# EAGLE design farmcontroller (EAGLE 8.3.0)
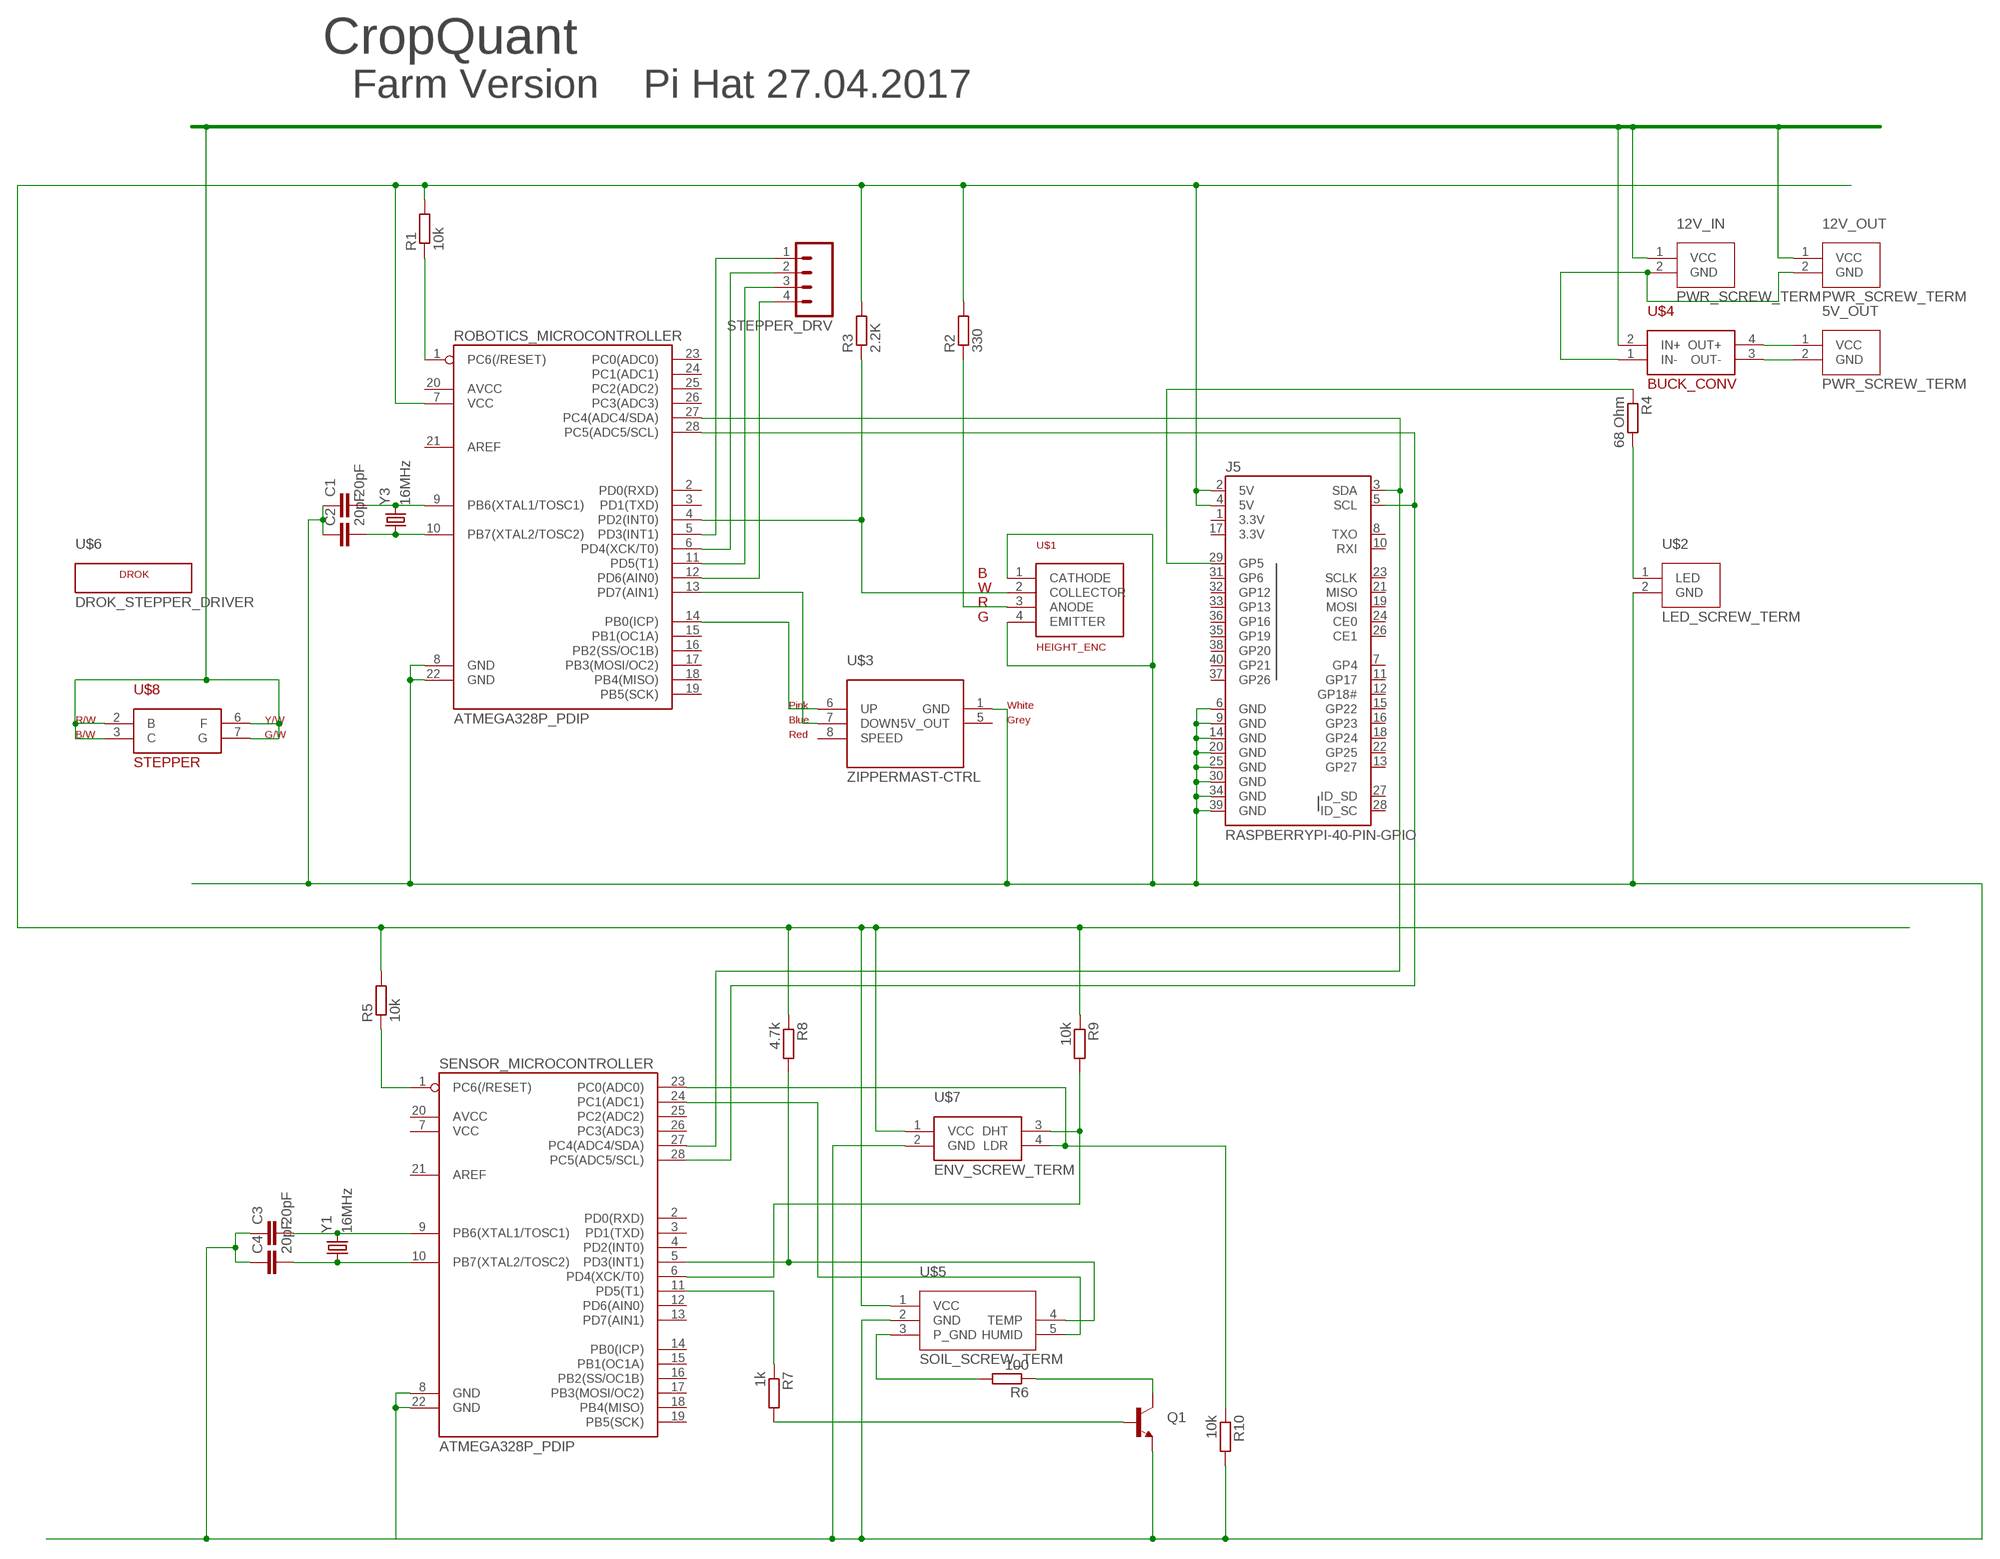
[diagram p0: schematic, sheet 1]

## Parts
5V_OUT  PWR_SCREW_TERM  [PWR_SCREW_TERM]
12V_IN  PWR_SCREW_TERM  [PWR_SCREW_TERM]
12V_OUT  PWR_SCREW_TERM  [PWR_SCREW_TERM]
C1  20pF  CAPPTH  [CAP-PTH-SMALL]
C2  20pF  CAPPTH  [CAP-PTH-SMALL]
C3  20pF  CAPPTH  [CAP-PTH-SMALL]
C4  20pF  CAPPTH  [CAP-PTH-SMALL]
J5  RASPBERRYPI-40-PIN-GPIO  [2X20-SHROUDED]
Q1  TRANSISTOR_NPNP2N2222A  [TO-92]
R1  10k  R-EU_0204/7  [0204/7]
R2  330  R-EU_0204/7  [0204/7]
R3  2.2K  R-EU_0204/7  [0204/7]
R4  68 Ohm  R-EU_0204/7  [0204/7]
R5  10k  R-EU_0204/7  [0204/7]
R6  100  R-EU_0204/7  [0204/7]
R7  1k  R-EU_0204/7  [0204/7]
R8  4.7k  R-EU_0204/7  [0204/7]
R9  10k  R-EU_0204/7  [0204/7]
R10  10k  R-EU_0204/7  [0204/7]
ROBOTICS_MICROCONTROLLER  ATMEGA328P_PDIP  [DIL28-3]
SENSOR_MICROCONTROLLER  ATMEGA328P_PDIP  [DIL28-3]
STEPPER_DRV  M04PTH  [1X04]
U$1  HEIGHT_ENC  [HEIGHT_ENC]
U$2  LED_SCREW_TERM  [LED_SCREW_TERM]
U$3  ZIPPERMAST-CTRL  [ZIPPERMAST-CTRL]
U$4  BUCK_CONV  [BUCK_CONV]
U$5  SOIL_SCREW_TERM  [SOIL_SCREW_TERM]
U$6  DROK_STEPPER_DRIVER  [DROK_STEPPER_DRIVER]
U$7  ENV_SCREW_TERM  [ENV_SCREW_TERM]
U$8  STEPPER  [STEPPER]
Y1  16MHz  CRYSTALHC49US  [HC49US]
Y3  16MHz  CRYSTALHC49US  [HC49US]

## Nets
N$1: R6.2 U$5.3(P_GND)
N$2: J5.2(5V) J5.4(5V) R1.2 R2.2 R3.2 R5.2 R8.1 R9.1 ROBOTICS_MICROCONTROLLER.7(VCC) U$5.1(VCC) U$7.1(VCC)
N$3: R1.1 ROBOTICS_MICROCONTROLLER.1(PC6(/RESET))
N$4: J5.3(SDA) ROBOTICS_MICROCONTROLLER.27(PC4(ADC4/SDA)) SENSOR_MICROCONTROLLER.27(PC4(ADC4/SDA))
N$5: J5.5(SCL) ROBOTICS_MICROCONTROLLER.28(PC5(ADC5/SCL)) SENSOR_MICROCONTROLLER.28(PC5(ADC5/SCL))
N$6: ROBOTICS_MICROCONTROLLER.14(PB0(ICP)) U$3.6(UP)
N$7: ROBOTICS_MICROCONTROLLER.13(PD7(AIN1)) U$3.7(DOWN)
N$8: R5.1 SENSOR_MICROCONTROLLER.1(PC6(/RESET))
N$9: R2.1 U$1.3(ANODE)
N$10: R3.1 ROBOTICS_MICROCONTROLLER.4(PD2(INT0)) U$1.2(COLLECTOR)
N$11: 12V_IN.1(VCC) 12V_OUT.1(VCC) U$4.2(IN+) U$8.2(B) U$8.3(C) U$8.6(F) U$8.7(G)
N$12: C2.2 ROBOTICS_MICROCONTROLLER.10(PB7(XTAL2/TOSC2)) Y3.1
N$13: C3.2 SENSOR_MICROCONTROLLER.9(PB6(XTAL1/TOSC1)) Y1.2
N$14: R4.2 U$2.1(LED)
N$15: J5.29(GP5) R4.1
N$16: C4.2 SENSOR_MICROCONTROLLER.10(PB7(XTAL2/TOSC2)) Y1.1
N$17: 12V_IN.2(GND) 12V_OUT.2(GND) U$4.1(IN-)
N$18: 5V_OUT.1(VCC) U$4.4(OUT+)
N$19: 5V_OUT.2(GND) U$4.3(OUT-)
N$20: C1.2 ROBOTICS_MICROCONTROLLER.9(PB6(XTAL1/TOSC1)) Y3.2
N$21: Q1.1(C) R6.1
N$22: C1.1 C2.1 C3.1 C4.1 J5.6(GND) J5.9(GND) J5.14(GND) J5.20(GND) J5.25(GND) J5.30(GND) J5.34(GND) J5.39(GND) Q1.3(E) R10.2 ROBOTICS_MICROCONTROLLER.8(GND) ROBOTICS_MICROCONTROLLER.22(GND) SENSOR_MICROCONTROLLER.8(GND) SENSOR_MICROCONTROLLER.22(GND) U$1.1(CATHODE) U$1.4(EMITTER) U$2.2(GND) U$3.1(GND) U$5.2(GND) U$7.2(GND)
N$23: Q1.2(B) R7.2
N$24: ROBOTICS_MICROCONTROLLER.5(PD3(INT1)) STEPPER_DRV.1
N$25: R7.1 SENSOR_MICROCONTROLLER.11(PD5(T1))
N$26: ROBOTICS_MICROCONTROLLER.6(PD4(XCK/T0)) STEPPER_DRV.2
N$27: ROBOTICS_MICROCONTROLLER.11(PD5(T1)) STEPPER_DRV.3
N$28: ROBOTICS_MICROCONTROLLER.12(PD6(AIN0)) STEPPER_DRV.4
N$29: SENSOR_MICROCONTROLLER.24(PC1(ADC1)) U$5.5(HUMID)
N$30: R8.2 SENSOR_MICROCONTROLLER.5(PD3(INT1)) U$5.4(TEMP)
N$31: R9.2 SENSOR_MICROCONTROLLER.6(PD4(XCK/T0)) U$7.3(DHT)
N$32: R10.1 SENSOR_MICROCONTROLLER.23(PC0(ADC0)) U$7.4(LDR)
Unconnected: J5.7(GP4) J5.8(TXO) J5.10(RXI) J5.11(GP17) J5.12(GP18#) J5.13(GP27) J5.15(GP22) J5.16(GP23) J5.18(GP24) J5.19(MOSI) J5.21(MISO) J5.22(GP25) J5.23(SCLK) J5.24(CE0) J5.26(CE1) J5.27(ID_SD) J5.28(ID_SC) J5.31(GP6) J5.32(GP12) J5.33(GP13) J5.35(GP19) J5.36(GP16) J5.37(GP26) J5.38(GP20) J5.40(GP21) ROBOTICS_MICROCONTROLLER.2(PD0(RXD)) ROBOTICS_MICROCONTROLLER.3(PD1(TXD)) ROBOTICS_MICROCONTROLLER.15(PB1(OC1A)) ROBOTICS_MICROCONTROLLER.16(PB2(SS/OC1B)) ROBOTICS_MICROCONTROLLER.17(PB3(MOSI/OC2)) ROBOTICS_MICROCONTROLLER.18(PB4(MISO)) ROBOTICS_MICROCONTROLLER.19(PB5(SCK)) ROBOTICS_MICROCONTROLLER.20(AVCC) ROBOTICS_MICROCONTROLLER.21(AREF) ROBOTICS_MICROCONTROLLER.23(PC0(ADC0)) ROBOTICS_MICROCONTROLLER.24(PC1(ADC1)) ROBOTICS_MICROCONTROLLER.25(PC2(ADC2)) ROBOTICS_MICROCONTROLLER.26(PC3(ADC3)) SENSOR_MICROCONTROLLER.2(PD0(RXD)) SENSOR_MICROCONTROLLER.3(PD1(TXD)) SENSOR_MICROCONTROLLER.4(PD2(INT0)) SENSOR_MICROCONTROLLER.7(VCC) SENSOR_MICROCONTROLLER.12(PD6(AIN0)) SENSOR_MICROCONTROLLER.13(PD7(AIN1)) SENSOR_MICROCONTROLLER.14(PB0(ICP)) SENSOR_MICROCONTROLLER.15(PB1(OC1A)) SENSOR_MICROCONTROLLER.16(PB2(SS/OC1B)) SENSOR_MICROCONTROLLER.17(PB3(MOSI/OC2)) SENSOR_MICROCONTROLLER.18(PB4(MISO)) SENSOR_MICROCONTROLLER.19(PB5(SCK)) SENSOR_MICROCONTROLLER.20(AVCC) SENSOR_MICROCONTROLLER.21(AREF) SENSOR_MICROCONTROLLER.25(PC2(ADC2)) SENSOR_MICROCONTROLLER.26(PC3(ADC3)) U$3.5(5V_OUT) U$3.8(SPEED)

## Notes on the sheet
- CropQuant
- Farm Version | Pi Hat 27.04.2017

## Power pins joined to a net without a drawn wire
3.3V: J5.1(3.3V) J5.17(3.3V)

## Library data of the parts
5V_OUT 12V_IN 12V_OUT = 000_CropQuant:PWR_SCREW_TERM
C1-C4 = SparkFun-Capacitors:CAP: Capacitor Standard 0603 ceramic capacitor, and 0.1" leaded capacitor.
J5 = CropQuant:RASPBERRYPI-40-PIN-GPIO: Second Generation Raspberry Pi GPIO Header 2x20 pin connector, as found on B, B+, A+ models.
Q1 = 001_SparkFun-DiscreteSemi:TRANSISTOR_NPN: Generic NPN BJT MMBT2222A - TRANS-08049 (SOT-23, 1A 40V) MPSA42 - TRANS-09116 (SOT-23, 500mA 300V) MMBT5088LT1G - TRANS-11160 (SOT-23, 50 mA 30V) BC547 - COM-08928 <http://www.sparkfun.com/products/8928> (TO-92 45V 100mA) (1.Collector 2.Base 3.Emitter) 2N3904 - COM-00521 <http://www.sparkfun.com/products/521> (TO-92 40V 200mA) (1.Emitter 2.Base 3.Collector) P2N2222A - COM-12852 <http://www.sparkfun.com/products/12852> (TO-92 40V 600mA) (1.Collector 2.Base 3.Emitter); PROD_ID: TRANS-09536
R1-R10 = resistor:R-EU_: RESISTOR, European symbol
ROBOTICS_MICROCONTROLLER SENSOR_MICROCONTROLLER = 001_SparkFun-DigitalIC:ATMEGA328P_PDIP: uC used in the Arduino 32kb flash, 1k EEPROM, 2k SRAM This is the through-hole version of this chip.
STEPPER_DRV = SparkFun-Connectors:M04: Header 4 Standard 4-pin 0.1" header. Use with straight break away headers (SKU : PRT-00116), right angle break away headers (PRT-00553), swiss pins (PRT-00743), machine pins (PRT-00117), and female headers (PRT-00115). Molex polarized connector foot print use with SKU : PRT-08231 with associated crimp pins and housings. 1MM SMD Version SKU: PRT-10208; PROD_ID: CONN-09696
U$1 = 000_CropQuant:HEIGHT_ENC
U$2 = 000_CropQuant:LED_SCREW_TERM
U$3 = 000_CropQuant:ZIPPERMAST-CTRL
U$4 = CropQuant:BUCK_CONV
U$5 = 000_CropQuant:SOIL_SCREW_TERM
U$6 = CropQuant:DROK_STEPPER_DRIVER
U$7 = 000_CropQuant:ENV_SCREW_TERM
U$8 = 000_CropQuant:STEPPER
Y1 Y3 = 001_SparkFun-FreqCtrl:CRYSTAL: Various standard crystals. Proven footprints.

## Board
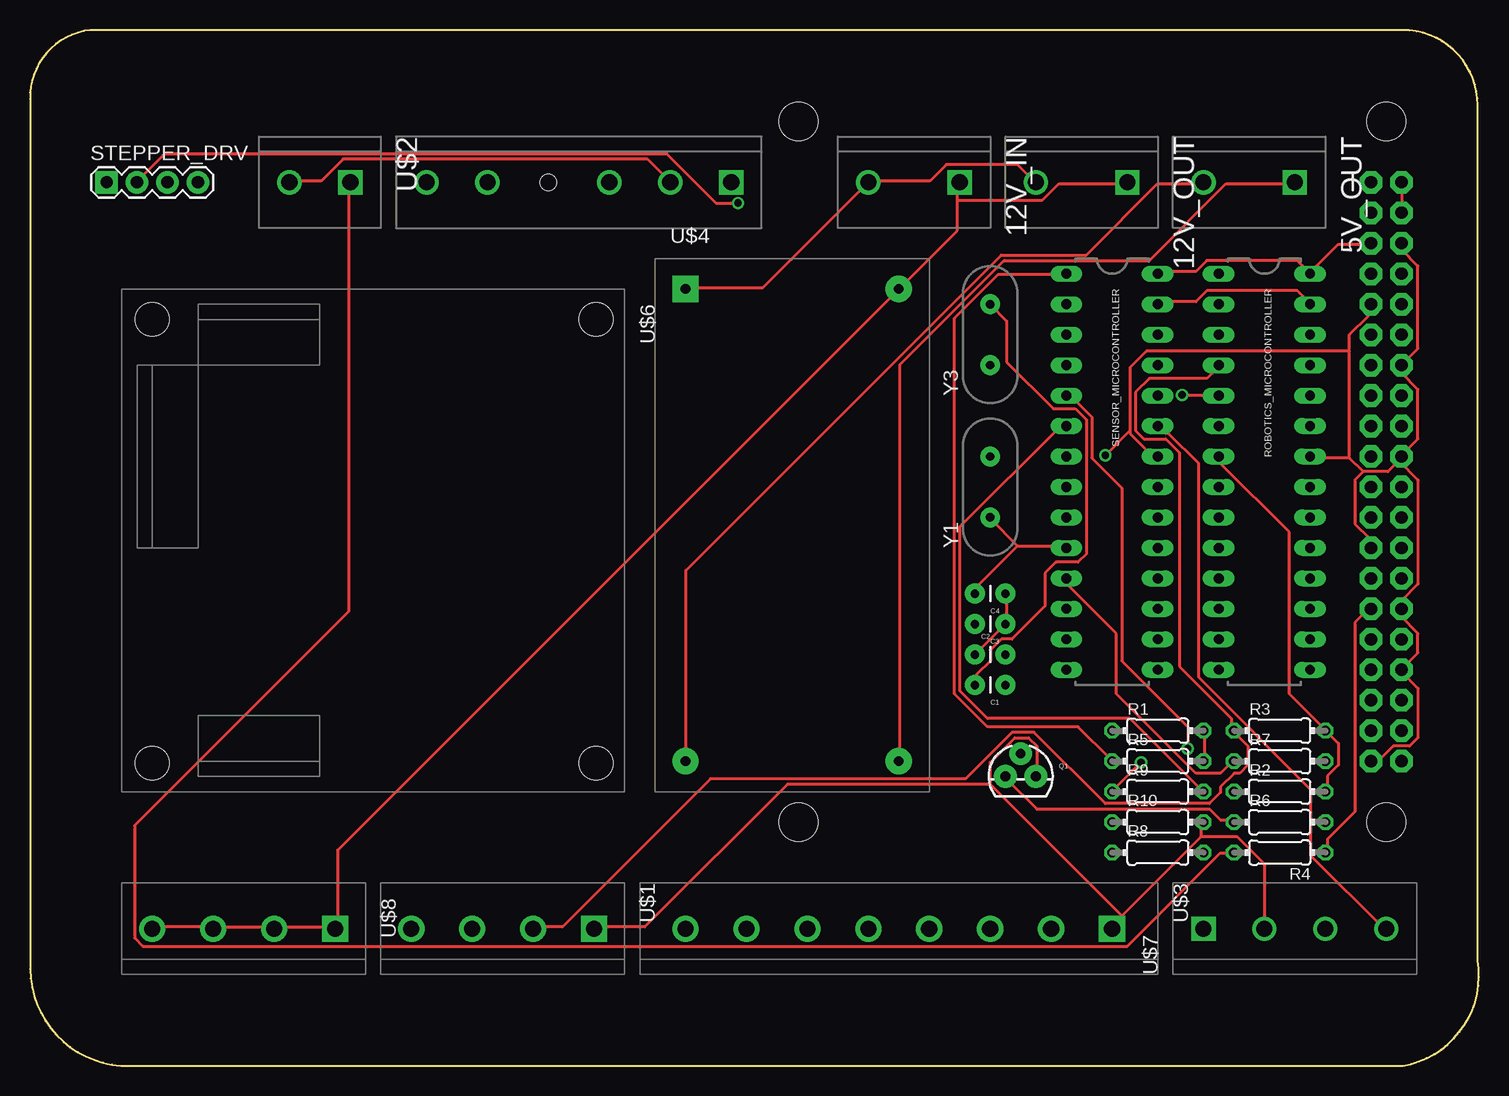
[diagram p1: board, top side]
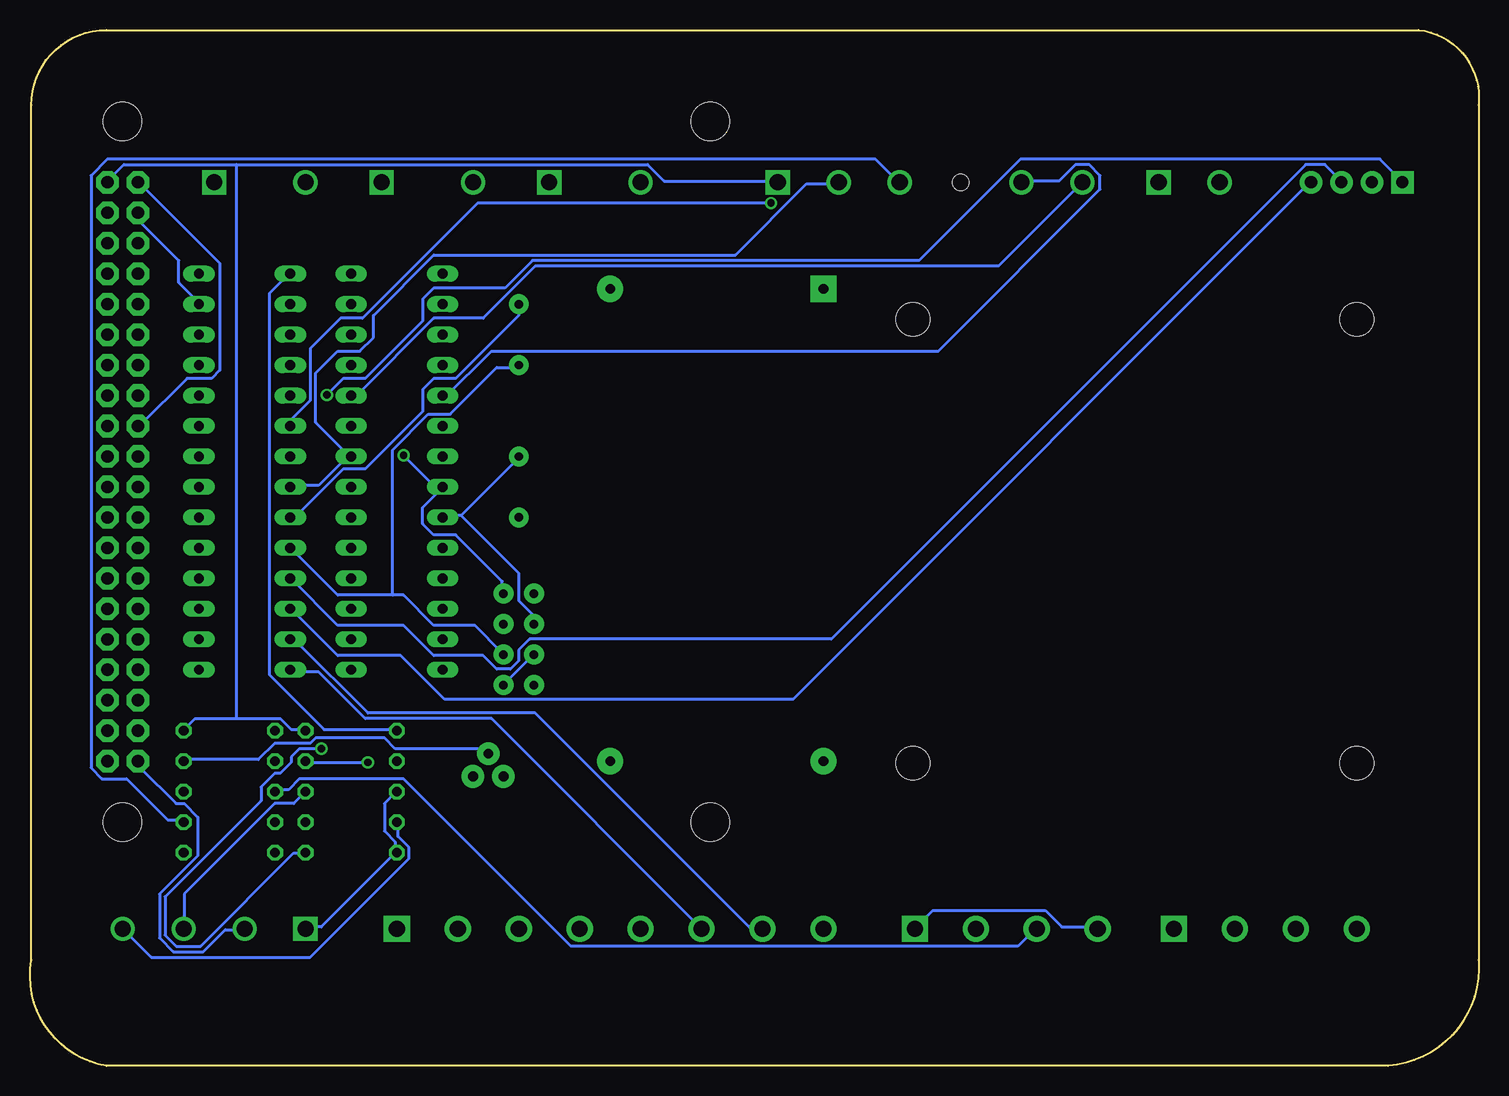
[diagram p2: board, bottom side, seen from below]

Size 120.79 x 86.36 mm. Coordinates in mm from the lower left corner, seen from the top.
Outline: 120.68,8.81 120.68,80.09 arc90 114.41,86.36 5.03,86.36 arc90 0.03,80.09 0.03,8.81 arc90 7.57,0 114.41,0 arc90 120.68,8.81
Copper layers (1*16): Top 0.035mm / dielectric 1.5mm / Bottom 0.035mm
Design rules "default": minimum track width 10mil, minimum drill 24mil, track to track 8mil, track to pad 8mil, pad to pad 8mil, via to via 8mil, smd to smd 8mil, copper to edge 40mil, drill to drill 8mil, minimum pad ring 10mil, minimum via ring 8mil, stop-mask expansion 4mil, vias tented up to drill 0mil, thermal gap 10mil

### Footprints (pad centres in the part's own frame; a part is rotated, then mirrored left to right if it is on the bottom)
PWR_SCREW_TERM = drill 1.346 square: 1 0,3.81 | drill 1.346: 2 0,-3.81
CAP-PTH-SMALL = drill 0.7 pad 1.651: 1 0,0; 2 2.54,0
2X20-SHROUDED = drill 1.016 pad 1.88 octagon: 1 -1.27,24.13; 2 1.27,24.13; 3 -1.27,21.59; 4 1.27,21.59; 5 -1.27,19.05; 6 1.27,19.05; 7 -1.27,16.51; 8 1.27,16.51; 9 -1.27,13.97; 10 1.27,13.97; 11 -1.27,11.43; 12 1.27,11.43; 13 -1.27,8.89; 14 1.27,8.89; 15 -1.27,6.35; 16 1.27,6.35; 17 -1.27,3.81; 18 1.27,3.81; 19 -1.27,1.27; 20 1.27,1.27; 21 -1.27,-1.27; 22 1.27,-1.27; 23 -1.27,-3.81; 24 1.27,-3.81; 25 -1.27,-6.35; 26 1.27,-6.35; 27 -1.27,-8.89; 28 1.27,-8.89; 29 -1.27,-11.43; 30 1.27,-11.43; 31 -1.27,-13.97; 32 1.27,-13.97; 33 -1.27,-16.51; 34 1.27,-16.51; 35 -1.27,-19.05; 36 1.27,-19.05; 37 -1.27,-21.59; 38 1.27,-21.59; 39 -1.27,-24.13; 40 1.27,-24.13 | hole 3.2: 0,29.21; 0,-29.21; -49,29.21; -49,-29.21
TO-92 = drill 0.813 pad 1.88: 1 -1.27,0; 2 0,1.905; 3 1.27,0
0204/7 = drill 0.813 octagon: 1 -3.81,0; 2 3.81,0
DIL28-3 = drill 0.813 long: 1 -16.51,-3.81; 2 -13.97,-3.81; 3 -11.43,-3.81; 4 -8.89,-3.81; 5 -6.35,-3.81; 6 -3.81,-3.81; 7 -1.27,-3.81; 8 1.27,-3.81; 9 3.81,-3.81; 10 6.35,-3.81; 11 8.89,-3.81; 12 11.43,-3.81; 13 13.97,-3.81; 14 16.51,-3.81; 15 16.51,3.81; 16 13.97,3.81; 17 11.43,3.81; 18 8.89,3.81; 19 6.35,3.81; 20 3.81,3.81; 21 1.27,3.81; 22 -1.27,3.81; 23 -3.81,3.81; 24 -6.35,3.81; 25 -8.89,3.81; 26 -11.43,3.81; 27 -13.97,3.81; 28 -16.51,3.81
1X04 = drill 1.016 pad 1.88 square: 1 0,0 | drill 1.016 pad 1.88: 2 2.54,0; 3 5.08,0; 4 7.62,0
HEIGHT_ENC = drill 1.346 pad 2.184 square: 1 0,7.62 | drill 1.346 pad 2.184: 2 0,2.54; 3 0,-2.54; 4 0,-7.62
LED_SCREW_TERM = drill 1.346 square: 1 0,2.54 | drill 1.346: 2 0,-2.54
ZIPPERMAST-CTRL = drill 1.346 pad 2.184 square: 1 0,17.78 | drill 1.346 pad 2.184: 2 0,12.7; 3 0,7.62; 4 0,2.54; 5 0,-2.54; 6 0,-7.62; 7 0,-12.7; 8 0,-17.78
BUCK_CONV = drill 0.8 pad 2.184 square: 1 -8.89,16.51 | drill 0.8 pad 2.184: 2 8.89,16.51; 3 -8.89,-22.86; 4 8.89,-22.86
SOIL_SCREW_TERM = drill 1.346 square: 1 0,12.7 | drill 1.346: 2 0,7.62; 3 0,2.54; 4 0,-7.62; 5 0,-12.7 | hole 1.346: 0,-2.54
DROK_STEPPER_DRIVER = hole 2.8: -19.05,-17.78; 17.95,19.22; 17.95,-17.78; -19.05,19.22
ENV_SCREW_TERM = drill 1.346 square: 1 0,7.62 | drill 1.346: 2 0,2.54; 3 0,-2.54; 4 0,-7.62
STEPPER = drill 1.346 pad 2.184 square: 2 0,7.62 | drill 1.346 pad 2.184: 3 0,2.54; 6 0,-2.54; 7 0,-7.62
HC49US = drill 0.7 pad 1.651: 1 -2.54,0; 2 2.54,0

### Placement (x,y rotation side)
5V_OUT  101.63,73.66 270 top
12V_IN  73.69,73.66 270 top
12V_OUT  87.66,73.66 270 top
C1  81.31,31.75 180 top
C2  78.77,34.29 0 top
C3  81.31,36.83 180 top
C4  81.31,39.37 180 top
J5  113.06,49.53 0 top
Q1  82.58,24.13 0 top
R1  94.01,27.94 0 top
R2  104.17,22.86 0 top
R3  104.17,27.94 0 top
R4  104.17,17.78 180 top
R5  94.01,25.4 0 top
R6  104.17,20.32 0 top
R7  104.17,25.4 0 top
R8  94.01,17.78 0 top
R9  94.01,22.86 0 top
R10  94.01,20.32 0 top
ROBOTICS_MICROCONTROLLER  102.9,49.53 270 top
SENSOR_MICROCONTROLLER  90.2,49.53 270 top
STEPPER_DRV  6.38,73.66 0 top
U$1  39.4,11.43 270 top
U$2  24.16,73.66 270 top
U$3  72.42,11.43 270 top
U$4  63.53,48.26 0 top
U$5  45.75,73.66 270 top
U$6  27.97,43.18 270 top
U$7  105.44,11.43 90 top
U$8  17.81,11.43 270 top
Y1  80.04,48.26 90 top
Y3  80.04,60.96 90 top

### Tracks (layer width: path | path; a pad name or v marks a point on that pad's centre or on a via)
3.3V
  Bottom 0.254: J5.17 111.59,53.42 107.71,57.3 105.65,57.3 104.96,57.99 104.96,66.9 111.59,73.53 J5.1
N$1
  Bottom 0.254: R6.2 108.16,20.5 109.31,20.5 112.73,23.93 114.79,23.93 115.71,24.84 115.71,74.22 114.33,75.59 50.33,75.59 48.5,73.76 U$5.3
N$2  (via drill 0.61)
  Top 0.254: R5.2 97.88,25.53 97.88,27.81 R1.2 | R2.2 108.16,23.01 108.16,24.15 109.08,25.07 109.08,26.9 108.16,27.81 R3.2 107.93,28.04 104.96,31.01 104.96,44.5 99.25,50.22 99.25,50.67 ROBOTICS_MICROCONTROLLER.7 | v92.62,25.3 90.33,23.01 R9.1 | J5.2 J5.4
  Bottom 0.254: R9.1 90.33,22.78 91.25,21.87 91.25,19.58 90.33,18.67 90.33,17.98 R8.1 90.33,17.75 96.5,11.58 97.65,11.58 U$7.1 | 103.59,28.96 107.02,28.96 107.93,28.04 R3.2 | 103.59,28.96 99.93,28.96 99.02,28.04 97.88,28.04 R1.2 | v92.62,25.3 97.65,25.3 R5.2 | 103.59,75.13 112.96,75.13 114.33,73.76 J5.2 | 103.59,75.13 69.3,75.13 67.93,73.76 58.56,73.76 U$5.1 | 103.59,75.13 103.59,28.96
N$3
  Bottom 0.254: R1.1 90.33,28.04 96.28,28.04 100.85,32.61 100.85,64.39 99.25,65.99 ROBOTICS_MICROCONTROLLER.1
N$4
  Top 0.254: SENSOR_MICROCONTROLLER.27 94.22,63.7 97.19,63.7 98.1,64.62 105.65,64.62 106.56,63.7 ROBOTICS_MICROCONTROLLER.27
  Bottom 0.254: J5.3 111.59,71.02 111.59,70.33 108.39,67.13 108.39,65.3 106.79,63.7 ROBOTICS_MICROCONTROLLER.27
N$5
  Top 0.254: SENSOR_MICROCONTROLLER.28 94.22,66.22 97.19,66.22 98.1,67.13 105.65,67.13 106.56,66.22 ROBOTICS_MICROCONTROLLER.28 106.79,66.22 109.08,68.5 111.59,68.5 J5.5
N$6
  Bottom 0.254: U$3.6 82.33,28.96 92.85,28.96 96.73,32.84 99.02,32.84 ROBOTICS_MICROCONTROLLER.14
N$7
  Bottom 0.254: ROBOTICS_MICROCONTROLLER.13 99.02,35.36 98.56,35.36 92.62,29.41 78.67,29.41 60.84,11.58 59.93,11.58 U$3.7
N$8
  Top 0.254: SENSOR_MICROCONTROLLER.1 86.22,65.99 80.73,65.99 77.07,62.33 77.07,31.01 79.82,28.27 87.36,28.27 90.1,25.53 R5.1
N$9
  Bottom 0.254: R2.1 100.16,23.01 99.25,23.01 98.33,23.93 89.65,23.93 75.7,9.98 38.44,9.98 37.07,11.35 U$1.3
N$10
  Top 0.254: ROBOTICS_MICROCONTROLLER.4 99.02,58.22 98.1,57.3 93.3,57.3 92.16,56.16 92.16,52.96 92.85,52.27 94.67,52.27 95.82,51.13 95.82,33.3 100.16,28.96 100.16,28.04 R3.1 100.39,27.81 101.53,26.67 101.53,25.07 100.85,24.38 100.39,24.38 99.25,23.24 99.25,22.78 98.33,21.87 89.65,21.87 83.7,27.81 81.87,27.81 77.99,23.93 56.73,23.93 44.38,11.58 42.1,11.58 U$1.2
N$11
  Top 0.254: U$8.7 10.32,11.58 15.12,11.58 U$8.6 15.35,11.58 20.15,11.58 U$8.3 20.38,11.58 25.41,11.58 U$8.2 25.64,11.58 25.64,17.98 U$4.2 77.3,69.65 77.3,72.16 | 77.3,72.16 77.3,73.53 12V_IN.1 | 77.3,72.16 84.39,72.16 85.76,73.53 91.47,73.53 12V_OUT.1
N$12
  Bottom 0.254: 90.56,39.24 89.65,39.24 87.13,36.73 83.7,36.73 81.42,34.44 C2.2 | 90.56,39.24 95.13,39.24 99.02,43.13 ROBOTICS_MICROCONTROLLER.10 | 90.56,39.24 90.56,51.36 87.59,54.33 85.76,54.33 81.87,58.22 80.04,58.22 Y3.1
N$13
  Bottom 0.254: 84.85,45.87 86.22,45.87 SENSOR_MICROCONTROLLER.9 | 84.85,45.87 80.04,50.67 Y1.2 | 84.85,45.87 80.04,41.07 80.04,38.79 78.9,37.64 78.9,36.96 C3.2
N$14
  Top 0.254: R4.2 100.16,17.75 99.25,17.75 91.47,9.98 9.41,9.98 8.72,10.67 8.72,20.04 26.55,37.87 26.55,73.53 U$2.1
N$15
  Top 0.254: R4.1 108.16,17.98 108.16,18.9 110.45,21.18 110.45,36.96 111.59,38.1 J5.29
N$16
  Top 0.254: 82.33,43.36 86.22,43.36 SENSOR_MICROCONTROLLER.10 | 82.33,43.36 80.04,45.64 Y1.1 | 82.33,43.36 78.9,39.93 78.9,39.47 C4.2
N$17
  Top 0.254: 12V_OUT.2 83.7,73.76 82.33,75.13 76.39,75.13 75.02,73.76 69.99,73.76 12V_IN.2 61.07,64.85 54.67,64.85 U$4.1
N$18
  Top 0.254: 5V_OUT.1 105.42,73.53 99.7,73.53 93.3,67.13 81.19,67.13 72.5,58.45 72.5,25.53 U$4.4
N$19
  Top 0.254: 5V_OUT.2 97.65,73.53 93.99,73.53 88.05,67.59 80.96,67.59 54.67,41.3 54.67,25.53 U$4.3
N$20
  Top 0.254: C1.2 78.9,31.93 78.9,32.61 80.04,33.76 80.04,34.67 80.96,35.59 81.87,35.59 84.62,38.33 84.62,41.07 85.53,41.99 87.36,41.99 88.05,42.67 88.05,53.87 87.13,54.79 85.3,54.79 81.42,58.67 81.42,62.1 80.04,63.48 Y3.2
  Bottom 0.254: Y3.2 80.04,62.56 85.3,57.3 87.13,57.3 88.05,56.39 88.05,54.56 92.85,49.76 94.67,49.76 98.56,45.87 99.02,45.87 ROBOTICS_MICROCONTROLLER.9
N$21
  Top 0.254: R6.1 100.16,20.5 99.25,20.5 98.33,21.41 83.93,21.41 81.42,23.93 Q1.1
N$22  (via drill 0.61)
  Top 0.254: 97.65,19.13 97.65,20.27 R10.2 | 91.02,12.5 90.1,11.58 U$3.1 91.02,12.5 | 91.02,12.5 97.65,19.13 | 80.04,23.47 80.04,25.3 82.1,27.36 83.24,27.36 83.93,26.67 83.93,24.15 Q1.3 | 91.02,12.5 80.04,23.47 | U$7.2 102.9,16.84 100.62,19.13 97.65,19.13 | 80.04,23.47 63.13,23.47 51.24,11.58 47.13,11.58 U$1.1 | U$2.2 21.75,73.76 24.27,73.76 26.09,75.59 51.47,75.59 53.3,73.76 U$5.2 | C2.1 78.9,34.44 81.19,36.73 C3.1 81.42,36.96 81.42,39.24 C4.1 | J5.39 111.82,25.53 112.51,25.53 113.65,26.67 115.02,26.67 115.71,27.36 115.71,31.47 114.33,32.84 J5.34 114.33,33.07 115.71,34.44 115.71,36.04 114.33,37.41 J5.30 114.33,38.79 115.71,40.16 115.71,48.84 114.11,50.44 | 109.99,50.67 106.79,50.67 ROBOTICS_MICROCONTROLLER.22 | 111.13,49.53 109.99,50.67 | 111.13,49.53 113.19,49.53 114.11,50.44 | 114.11,50.44 114.33,50.67 J5.20 | 111.13,49.53 110.45,48.84 110.45,45.19 111.59,44.04 111.59,43.36 J5.25 | J5.20 114.33,50.9 115.71,52.27 115.71,56.39 114.33,57.76 J5.14 114.33,58.45 115.71,59.82 115.71,66.67 114.33,68.05 J5.6 | 109.99,50.67 109.99,59.59 | 109.99,59.59 109.99,60.96 111.59,62.56 111.59,63.48 J5.9 | 91.7,52.96 91.7,58.22 93.07,59.59 109.99,59.59 | 91.7,52.96 91.7,52.73 93.53,50.9 93.99,50.9 SENSOR_MICROCONTROLLER.22 | 114.11,50.44 J5.20 | 91.7,52.96 v89.65,50.9
  Bottom 0.254: U$1.4 31.81,11.58 34.78,11.58 36.15,12.95 45.53,12.95 46.9,11.58 U$1.1 | C1.1 81.19,31.93 78.9,34.21 C2.1 | 86.67,47.93 88.05,46.56 88.05,45.19 87.13,44.27 85.3,44.27 81.42,40.39 81.42,39.47 C4.1 | 86.67,47.93 86.45,48.16 SENSOR_MICROCONTROLLER.8 86.67,47.93 | 94.22,50.9 96.73,48.39 99.02,48.39 ROBOTICS_MICROCONTROLLER.8 | v89.65,50.9 86.67,47.93 | 94.22,50.9 96.96,53.65 96.96,57.76 95.13,59.59 93.3,59.59 92.16,60.73 92.16,62.56 87.13,67.59 61.99,67.59 56.04,73.53 53.53,73.53 U$5.2 | 94.22,50.9 SENSOR_MICROCONTROLLER.22 | U$7.2 102.9,11.35 104.5,11.35 106.33,9.53 108.85,9.53 109.99,10.67 109.99,14.33 106.79,17.53 106.79,20.73 107.93,21.87 108.62,21.87 111.59,24.84 111.59,25.3 J5.39
N$23
  Bottom 0.254: R7.2 107.93,25.53 101.76,25.53 100.39,26.9 97.42,26.9 96.96,27.36 91.25,27.36 90.33,26.44 83.02,26.44 82.79,26.21 Q1.2
N$24  (via drill 0.61)
  Top 0.254: v96.05,55.93 99.02,55.93 ROBOTICS_MICROCONTROLLER.5
  Bottom 0.254: v96.05,55.93 94.67,57.3 92.85,57.3 88.05,62.1 88.05,63.93 87.13,64.85 81.19,64.85 78.9,67.13 46.67,67.13 38.21,75.59 8.26,75.59 6.44,73.76 STEPPER_DRV.1
N$25
  Top 0.254: SENSOR_MICROCONTROLLER.11 86.45,40.62 86.45,40.16 90.56,36.04 90.56,31.01 97.19,24.38 99.25,24.38 100.16,25.3 R7.1
N$26  (via drill 0.61)
  Top 0.254: v59.01,71.93 57.18,71.93 53.07,76.05 11.24,76.05 8.95,73.76 STEPPER_DRV.2
  Bottom 0.254: v59.01,71.93 83.47,71.93 93.07,62.33 94.9,62.33 97.42,59.82 97.42,55.47 99.02,53.87 99.02,53.42 ROBOTICS_MICROCONTROLLER.6
N$27
  Bottom 0.254: ROBOTICS_MICROCONTROLLER.11 99.02,40.62 95.13,36.73 89.65,36.73 87.13,34.21 83.02,34.21 81.87,33.07 80.73,33.07 80.04,33.76 80.04,34.67 79.13,35.59 53.98,35.59 14.44,75.13 12.84,75.13 11.46,73.76 STEPPER_DRV.3
N$28
  Bottom 0.254: ROBOTICS_MICROCONTROLLER.12 99.02,38.1 95.13,34.21 89.87,34.21 86.22,30.56 57.18,30.56 14.21,73.53 STEPPER_DRV.4
N$29
  Bottom 0.254: U$5.5 40.04,66.67 78.67,66.67 83.02,62.33 87.13,62.33 93.53,55.93 93.99,55.93 SENSOR_MICROCONTROLLER.24
N$30  (via drill 0.61)
  Top 0.254: v96.5,26.44 96.5,28.27 91.02,33.76 91.02,48.16 88.5,50.67 88.5,54.1 86.9,55.7 86.45,55.7 SENSOR_MICROCONTROLLER.5
  Bottom 0.254: v96.5,26.44 98.33,26.44 99.02,25.76 99.02,25.3 99.93,24.38 100.39,24.38 101.53,23.24 101.53,22.1 109.53,14.1 109.53,10.9 108.62,9.98 106.56,9.98 98.79,17.75 97.88,17.75 R8.2 | U$5.4 37.98,73.76 35.01,73.76 33.64,75.13 32.5,75.13 31.58,74.22 31.58,73.08 45.07,59.59 82.33,59.59 86.22,55.7 SENSOR_MICROCONTROLLER.5
N$31
  Top 0.254: SENSOR_MICROCONTROLLER.6 86.22,53.19 85.76,53.19 77.53,44.96 77.53,31.24 79.82,28.96 91.7,28.96 97.65,23.01 R9.2
  Bottom 0.254: U$7.3 107.93,11.58 107.93,14.33 100.39,21.87 98.79,21.87 97.88,22.78 R9.2
N$32
  Top 0.254: SENSOR_MICROCONTROLLER.23 94.22,53.19 94.67,52.73 94.9,52.73 97.42,50.22 97.42,32.38 106.79,23.01 106.79,17.53 112.96,11.35 U$7.4
  Bottom 0.254: R10.1 90.1,20.27 90.1,19.13 89.19,18.21 89.19,17.3 97.42,9.07 110.68,9.07 112.96,11.35 U$7.4

### Text on the board
tDocu: LED | SOIL_SENSOR | 12V_IN | 12V_OUT | 5V_OUT | STEPPER | R | B | 16MHz | BUCK | CONV | STEPPER | DRIVER | 16MHz | SENSOR_MICROCONTROLLER | ROBOTICS_MICROCONTROLLER | 10k | 2.2k | 10k | 1k | 10k | 330 | Y | G | 10k | 100 | 4.7k | 68 | STEPPER | HEIGHT_ENCODER | ZIPPERMAST_CONTROL | ENV_SENSOR